# Altium project T-USB BQ10.PrjPcb (part 2 of 2)

## Sheet PCA9555.SchDoc
size A3; SheetNumber: 7; SheetTotal: 9
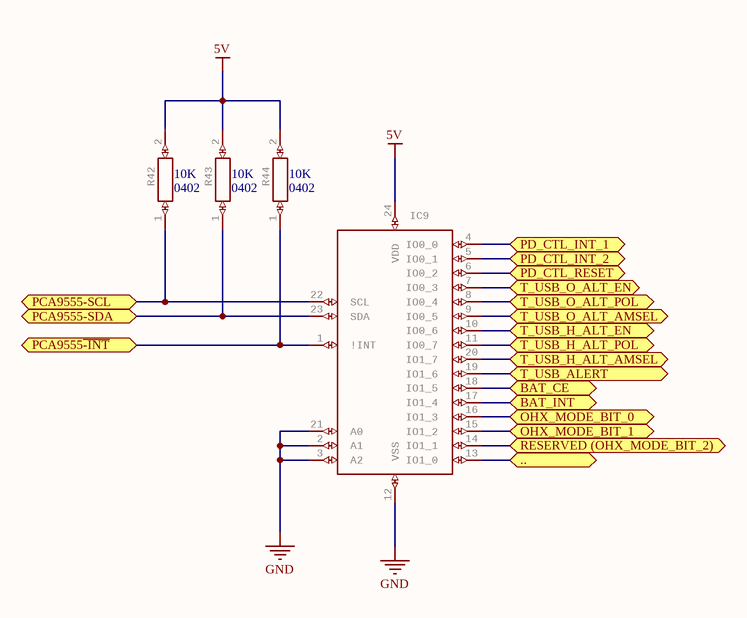
[diagram p10: PCA9555.SchDoc]

### Parts
IC9  Interface - I/O Expanders 16-BIT I2C FM TP GPIO INT PU   Source:  Datasheet  [SOIC127P1032X265-24N]  (value not drawn)
R42  value 10K  Package: 0402  [RESC1005X40N]  (hidden comment: GENERAL PURPOSE CHIP RESISTORS   Source:  Datasheet)
R43  value 10K  Package: 0402  [RESC1005X40N]  (hidden comment: GENERAL PURPOSE CHIP RESISTORS   Source:  Datasheet)
R44  value 10K  Package: 0402  [RESC1005X40N]  (hidden comment: GENERAL PURPOSE CHIP RESISTORS   Source:  Datasheet)

### Ports
.. (bidir), BAT_CE (bidir), BAT_INT (bidir), OHX_MODE_BIT_0 (bidir), OHX_MODE_BIT_1 (bidir), PCA9555-SCL (bidir), PCA9555-SDA (bidir), PCA9555~{-INT} (bidir), PD_CTL_INT_1 (bidir), PD_CTL_INT_2 (bidir), PD_CTL_RESET (bidir), RESERVED (OHX_MODE_BIT_2) (bidir), T_USB_ALERT (bidir), T_USB_H_ALT_AMSEL (bidir), T_USB_H_ALT_EN (bidir), T_USB_H_ALT_POL (bidir), T_USB_O_ALT_AMSEL (bidir), T_USB_O_ALT_EN (bidir), T_USB_O_ALT_POL (bidir)

### Nets
5V: IC9.24(VDD) R42.2 R43.2 R44.2  [project net PP_HV1]
GND: IC9.2(A1) IC9.3(A2) IC9.12(VSS) IC9.21(A0)
NetIC9_1: IC9.1(!INT) R44.1 ; port PCA9555~{-INT}
NetIC9_4: IC9.4(IO0_0) ; port PD_CTL_INT_1
NetIC9_5: IC9.5(IO0_1) ; port PD_CTL_INT_2
NetIC9_6: IC9.6(IO0_2) ; port PD_CTL_RESET
NetIC9_7: IC9.7(IO0_3) ; port T_USB_O_ALT_EN
NetIC9_8: IC9.8(IO0_4) ; port T_USB_O_ALT_POL
NetIC9_9: IC9.9(IO0_5) ; port T_USB_O_ALT_AMSEL
NetIC9_10: IC9.10(IO0_6) ; port T_USB_H_ALT_EN
NetIC9_11: IC9.11(IO0_7) ; port T_USB_H_ALT_POL
NetIC9_13: IC9.13(IO1_0) ; port ..
NetIC9_14: IC9.14(IO1_1) ; port RESERVED (OHX_MODE_BIT_2)
NetIC9_15: IC9.15(IO1_2) ; port OHX_MODE_BIT_1
NetIC9_16: IC9.16(IO1_3) ; port OHX_MODE_BIT_0
NetIC9_17: IC9.17(IO1_4) ; port BAT_INT
NetIC9_18: IC9.18(IO1_5) ; port BAT_CE
NetIC9_19: IC9.19(IO1_6) ; port T_USB_ALERT
NetIC9_20: IC9.20(IO1_7) ; port T_USB_H_ALT_AMSEL
NetIC9_22: IC9.22(SCL) R42.1 ; port PCA9555-SCL
NetIC9_23: IC9.23(SDA) R43.1 ; port PCA9555-SDA

### Library data of the parts
IC9 = PCA9555D,118: Manufacturer_Name: NXP; GateName_1: G$1; SymbolName_1: PCA9555D,118; LibraryName: PCA9555D_118; DeviceSetName: PCA9555D,118; Package: SOIC127P1032X265-24N; Manufacturer_Part_Number: PCA9555D,118; Mouser_Part_Number: 771-PCA9555D-T; Mouser_Price-Stock: https://www.mouser.co.uk/ProductDetail/NXP-Semiconductors/PCA9555D118?qs=LOCUfHb8d9tGZvX3C7Uu1g%3D%3D; Arrow_Part_Number: PCA9555D,118; Arrow_Price-Stock: https://www.arrow.com/en/products/pca9555d118/nxp-semiconductors?region=nac; Height: 2.65mm
R42-R44 = RC0402FR-071KL: Manufacturer_Name: KEMET; GateName_1: G$1; SymbolName_1: RC0402FR-071KL; LibraryName: RC0402FR-071KL; DeviceSetName: RC0402FR-071KL; Manufacturer_Part_Number: RC0402FR-071KL; Mouser_Part_Number: 603-RC0402FR-071KL; Mouser_Price-Stock: https://www.mouser.co.uk/ProductDetail/YAGEO/RC0402FR-071KL?qs=V1yeUXFNrknDEmWLmm5v6g%3D%3D; Arrow_Part_Number: RC0402FR-071KL; Arrow_Price-Stock: https://www.arrow.com/en/products/rc0402fr-071kl/yageo?region=nac; Height: 0.4mm

## Nets that join several sheets
3.3V: TPS65988 (IC1.5), HD3SS460-PORT 1 (IC2.23), HD3SS460-PORT2 (IC7.23), 45 Pin Connectors (10 pins)
GND: TPS65988 (14 pins), HD3SS460-PORT 1 (25 pins), TS5USBC41 (IC3.B3 IC4.B3 IC5.B3 IC6.B3), HD3SS460-PORT2 (25 pins), BQ24250 (20 pins), 2-50Pin B2B Connector (9 pins), 45 Pin Connectors (8 pins), PCA9555 (IC9.2 IC9.3 IC9.12 IC9.21)
PP_HV1: TPS65988 (18 pins), TS5USBC41 (IC3.B1 IC4.B1 IC5.B1 IC6.B1), BQ24250 (R32.2 R41.2), 2-50Pin B2B Connector (JP2.27 JP2.28), PCA9555 (IC9.24 R42.2 R43.2 R44.2)
VBUS: TPS65988 (6 pins), HD3SS460-PORT 1 (8 pins), HD3SS460-PORT2 (8 pins), BQ24250 (C33.2 IC8.19 R27.2 R28.2)
BQ24250-SCL: TPS65988 (IC1.27), BQ24250 (IC8.6 R32.1)
BQ24250-SDA: TPS65988 (IC1.28), BQ24250 (IC8.5 R41.1)
DP_UP: HD3SS460-PORT 1 (J.A6), TS5USBC41 (IC3.A2)
LDO: BQ24250 (C36.2 IC8.24 R30.2), 2-50Pin B2B Connector (JP1.30)
LVDS_CLK+: 2-50Pin B2B Connector (JP1.49), 45 Pin Connectors (J?#1.25)
LVDS_CLK-: 2-50Pin B2B Connector (JP1.50), 45 Pin Connectors (J?#1.26)
LVDS_D0+: 2-50Pin B2B Connector (JP1.47), 45 Pin Connectors (J?#1.28)
LVDS_D0-: 2-50Pin B2B Connector (JP1.46), 45 Pin Connectors (J?#1.29)
LVDS_D1+: 2-50Pin B2B Connector (JP1.44), 45 Pin Connectors (J?#1.31)
LVDS_D1-: 2-50Pin B2B Connector (JP1.43), 45 Pin Connectors (J?#1.32)
LVDS_D2+: 2-50Pin B2B Connector (JP1.41), 45 Pin Connectors (J?#1.34)
LVDS_D2-: 2-50Pin B2B Connector (JP1.40), 45 Pin Connectors (J?#1.35)
LVDS_D3+: 2-50Pin B2B Connector (JP1.38), 45 Pin Connectors (J?#1.37)
LVDS_D3-: 2-50Pin B2B Connector (JP1.37), 45 Pin Connectors (J?#1.38)
NetIC1_24: TPS65988 (IC1.24), HD3SS460-PORT 1 (J.A5)
NetIC1_26: TPS65988 (IC1.26), HD3SS460-PORT 1 (J.B5)
NetIC1_40: TPS65988 (IC1.40), 2-50Pin B2B Connector (JP2.9)
NetIC1_41: TPS65988 (IC1.41), 2-50Pin B2B Connector (JP2.10)
NetIC1_45: TPS65988 (IC1.45), HD3SS460-PORT2 (J1.A5)
NetIC1_47: TPS65988 (IC1.47), HD3SS460-PORT2 (J1.B5)
NetIC2_16: HD3SS460-PORT 1 (IC2.16), 45 Pin Connectors (J?#1.9)
NetIC2_17: HD3SS460-PORT 1 (IC2.17), 45 Pin Connectors (J?#1.8)
NetIC2_19: HD3SS460-PORT 1 (IC2.19), 45 Pin Connectors (J?#1.6)
NetIC2_20: HD3SS460-PORT 1 (IC2.20), 45 Pin Connectors (J?#1.5)
NetIC2_21: HD3SS460-PORT 1 (IC2.21), 45 Pin Connectors (J?#1.15)
NetIC2_22: HD3SS460-PORT 1 (IC2.22), 45 Pin Connectors (J?#1.14)
NetIC2_24: HD3SS460-PORT 1 (IC2.24), 45 Pin Connectors (J?#1.12)
NetIC2_25: HD3SS460-PORT 1 (IC2.25), 45 Pin Connectors (J?#1.11)
NetIC2_26: HD3SS460-PORT 1 (IC2.26), 2-50Pin B2B Connector (JP1.5)
NetIC2_27: HD3SS460-PORT 1 (IC2.27), 2-50Pin B2B Connector (JP1.6)
NetIC2_29: HD3SS460-PORT 1 (IC2.29), 2-50Pin B2B Connector (JP1.2)
NetIC2_30: HD3SS460-PORT 1 (IC2.30), 2-50Pin B2B Connector (JP1.3)
NetIC3_C1: TPS65988 (R1.2), TS5USBC41 (IC3.C1 IC5.C1), 2-50Pin B2B Connector (JP2.3)
NetIC3_C2: TPS65988 (R13.2), TS5USBC41 (IC3.C2 IC5.C2), 2-50Pin B2B Connector (JP2.4)
NetIC3_C3: TS5USBC41 (IC3.C3 IC5.C3), 45 Pin Connectors (J?#1.20)
NetIC3_C4: TS5USBC41 (IC3.C4 IC5.C4), 45 Pin Connectors (J?#1.21)
NetIC4_C1: TPS65988 (R12.2), TS5USBC41 (IC4.C1 IC6.C1), 2-50Pin B2B Connector (JP2.6)
NetIC4_C2: TPS65988 (R14.2), TS5USBC41 (IC4.C2 IC6.C2), 2-50Pin B2B Connector (JP2.7)
NetIC6_A2: TS5USBC41 (IC6.A2), HD3SS460-PORT2 (J1.B6)
NetIC6_A3: TS5USBC41 (IC6.A3), HD3SS460-PORT2 (J1.B7)
NetIC7_26: HD3SS460-PORT2 (IC7.26), 2-50Pin B2B Connector (JP1.11)
NetIC7_27: HD3SS460-PORT2 (IC7.27), 2-50Pin B2B Connector (JP1.12)
NetIC7_29: HD3SS460-PORT2 (IC7.29), 2-50Pin B2B Connector (JP1.8)
NetIC7_30: HD3SS460-PORT2 (IC7.30), 2-50Pin B2B Connector (JP1.9)
NetIC8_1: BQ24250 (IC8.1), 2-50Pin B2B Connector (JP2.24)
NetIC8_7: BQ24250 (IC8.7), 2-50Pin B2B Connector (JP1.25)
P1_DM_UP-B7: HD3SS460-PORT 1 (J.B7), TS5USBC41 (IC5.A3)
P1_DP_UP-B6: HD3SS460-PORT 1 (J.B6), TS5USBC41 (IC5.A2)
P2-ML0N: HD3SS460-PORT2 (IC7.19), 45 Pin Connectors (J?#2.6)
P2-ML0P: HD3SS460-PORT2 (IC7.20), 45 Pin Connectors (J?#2.5)
P2-ML1N: HD3SS460-PORT2 (IC7.16), 45 Pin Connectors (J?#2.9)
P2-ML1P: HD3SS460-PORT2 (IC7.17), 45 Pin Connectors (J?#2.8)
P2-ML2N: HD3SS460-PORT2 (IC7.24), 45 Pin Connectors (J?#2.12)
P2-ML2P: HD3SS460-PORT2 (IC7.25), 45 Pin Connectors (J?#2.11)
P2-ML3N: HD3SS460-PORT2 (IC7.21), 45 Pin Connectors (J?#2.15)
P2-ML3P: HD3SS460-PORT2 (IC7.22), 45 Pin Connectors (J?#2.14)
SBU1_45Pin2_3: HD3SS460-PORT2 (IC7.14 R25.2), 45 Pin Connectors (J?#2.3)
SBU1_460: HD3SS460-PORT 1 (IC2.14 R10.2), 45 Pin Connectors (J?#1.3)
SBU2_45Pin2_2: HD3SS460-PORT2 (IC7.15 R26.2), 45 Pin Connectors (J?#2.2)
SBU2_460: HD3SS460-PORT 1 (IC2.15 R11.2), 45 Pin Connectors (J?#1.2)